# EAGLE design sensoresard (EAGLE 7.7.0)
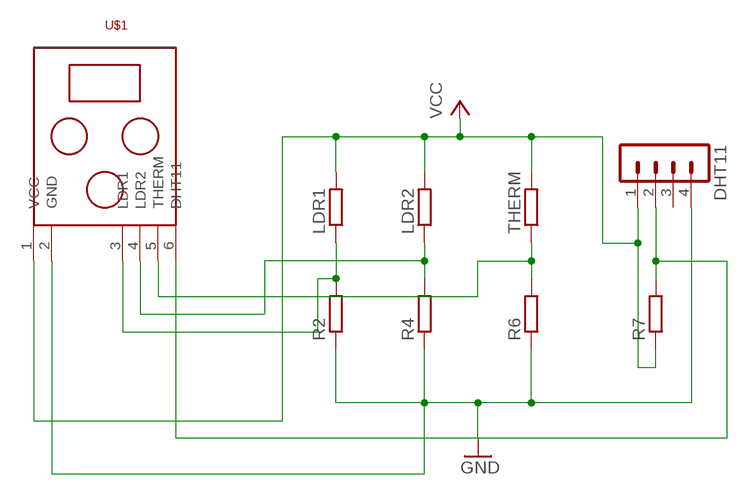
[diagram p0: schematic, sheet 1]

## Parts
DHT11  MA04-1  [MA04-1]
LDR1  R-EU_0204/7  [0204/7]
LDR2  R-EU_0204/7  [0204/7]
R2  R-EU_0204/7  [0204/7]
R4  R-EU_0204/7  [0204/7]
R6  R-EU_0204/7  [0204/7]
R7  R-EU_0204/7  [0204/7]
THERM  R-EU_0204/7  [0204/7]
U$1  PA  [PA]

## Nets
GND: DHT11.4 R2.1 R4.1 R6.1 U$1.2(GND)
N$1: LDR1.1 R2.2 U$1.3(LDR1)
N$2: LDR2.1 R4.2 U$1.4(LDR2)
N$3: R6.2 THERM.1 U$1.5(THERM)
N$4: DHT11.2 R7.2 U$1.6(DHT11)
VCC: DHT11.1 LDR1.2 LDR2.2 R7.1 THERM.2 U$1.1(VCC)
Unconnected: DHT11.3

## Library data of the parts
DHT11 = con-lstb:MA04-1: PIN HEADER; OC_FARNELL: unknown; OC_NEWARK: unknown
LDR1 LDR2 R2 R4 R6 R7 THERM = resistor:R-EU_: RESISTOR, European symbol
U$1 = sensorescaseros:PA

## Board
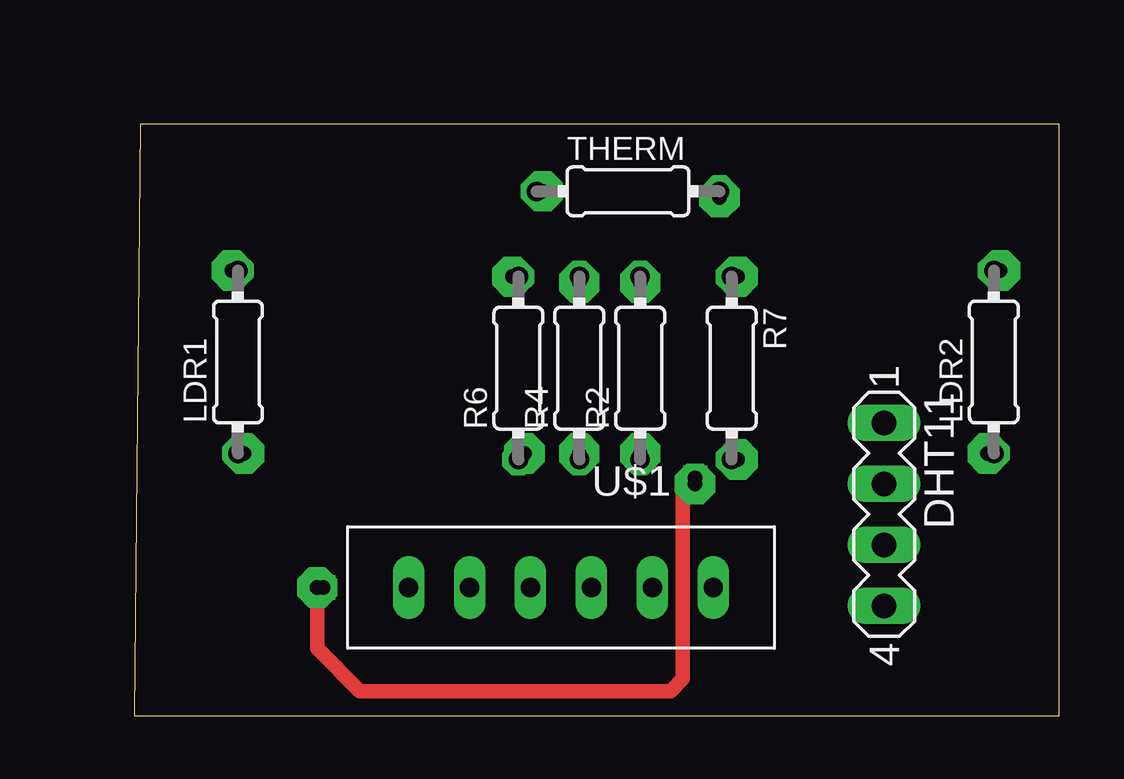
[diagram p1: board, top side]
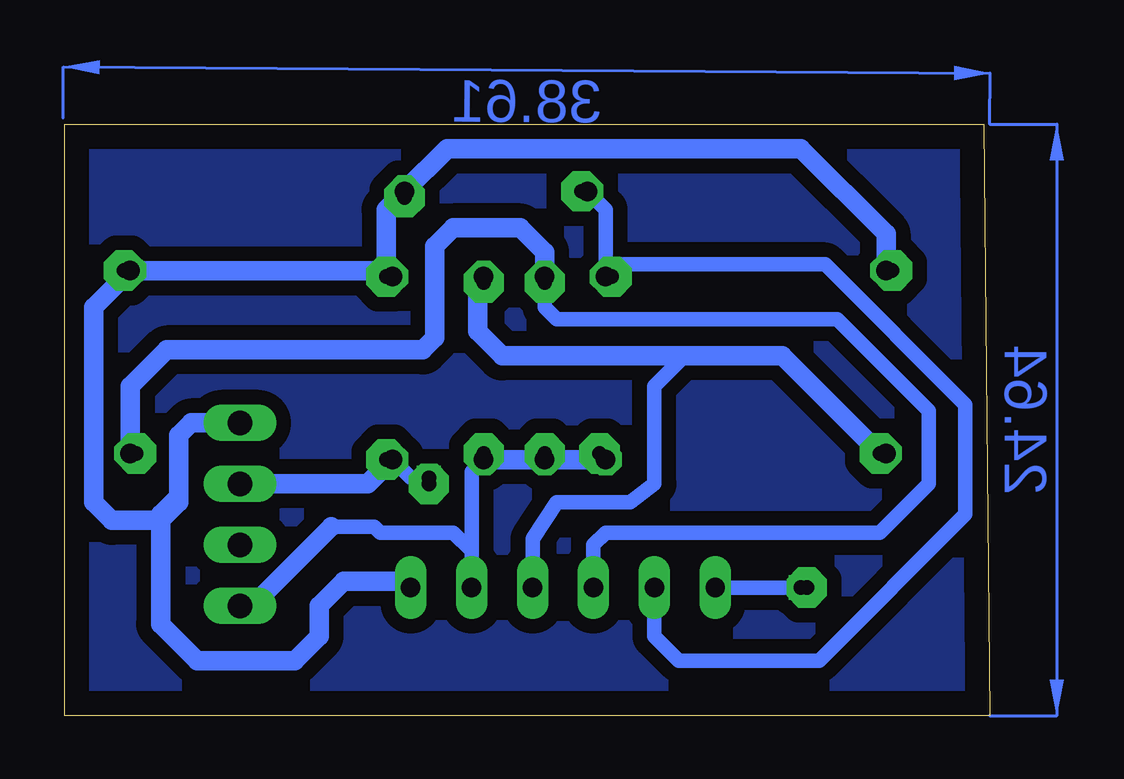
[diagram p2: board, bottom side, seen from below]

Size 38.53 x 24.63 mm. Coordinates in mm from the lower left corner, seen from the top.
Outline: 0,0 38.53,0 38.53,24.63 0.25,24.63 0,0
Copper layers (1*16): Top 0.035mm / dielectric 1.5mm / Bottom 0.035mm
Design rules "default": minimum track width 10mil, minimum drill 24mil, track to track 8mil, track to pad 8mil, pad to pad 8mil, via to via 8mil, smd to smd 8mil, copper to edge 40mil, drill to drill 8mil, minimum pad ring 10mil, minimum via ring 8mil, stop-mask expansion 4mil, vias tented up to drill 0mil, thermal gap 10mil

### Footprints (pad centres in the part's own frame; a part is rotated, then mirrored left to right if it is on the bottom)
MA04-1 = drill 1.016 long: 1 -3.81,0; 2 -1.27,0; 3 1.27,0; 4 3.81,0
0204/7 = drill 0.813 octagon: 1 -3.81,0; 2 3.81,0
PA = drill 0.8 long: 1 6.35,0; 2 3.81,0; 3 1.27,0; 4 -1.27,0; 5 -3.81,0; 6 -6.35,0

### Placement (x,y rotation side)
DHT11  31.24,8.38 270 top
LDR1  4.32,14.73 90 top
LDR2  35.81,14.73 90 top
R2  21.08,14.48 90 top
R4  18.54,14.48 90 top
R6  16,14.48 90 top
R7  24.89,14.48 270 top
THERM  20.57,21.84 0 top
U$1  17.78,5.33 0 top

### Tracks (layer width: path | path; a pad name or v marks a point on that pad's centre or on a via)
GND
  Bottom 0.61: 27.43,7.87 25.65,7.87 25.4,7.62 22.35,7.62 21.59,6.86 U$1.2 21.59,10.16 R2.1
  Bottom 0.813: R6.1 R4.1 R2.1 | DHT11.4 30.73,4.57 27.43,7.87
N$1  (via drill 0.6 pad 1.68)
  Bottom 0.61: U$1.3 19.05,7.37 18.03,8.89 14.99,8.89 13.97,9.65 13.97,13.72 12.7,14.99
  Bottom 0.813: LDR1.1 v4.57,10.92 8.64,14.99 12.7,14.99 20.32,14.99 21.34,16 21.34,18.03 R2.2
N$2  (via drill 0.6 pad 1.68)
  Bottom 0.61: U$1.4 16.51,7.11 16,7.62 4.57,7.62 2.54,9.65 2.54,12.7 6.35,16.51 18.03,16.51 18.54,17.02 v18.54,18.03 R4.2
  Bottom 0.813: R4.2 18.54,19.3 19.56,20.32 22.35,20.32 23.11,19.56 23.11,15.75 23.62,15.24 34.29,15.24 35.81,13.72 LDR2.1
N$3
  Bottom 0.61: THERM.1 16,21.08 R6.2 15.49,18.8 6.86,18.8 1.02,12.95 1.02,8.38 7.11,2.29 12.95,2.29 13.97,3.3 U$1.5
N$4  (via drill 0.6, 0.6 pad 1.68)
  Top 0.61: v7.87,5.33 v7.62,5.33 7.62,2.79 9.4,1.02 22.35,1.02 22.86,1.52 22.86,9.4 v23.37,9.91
  Bottom 0.61: U$1.6 v7.87,5.33 | v23.37,9.91 24.13,9.91 R7.2
  Bottom 0.813: R7.2 25.91,9.65 DHT11.2
N$5
  pour Bottom (isolate 0.61): 0,0 38.86,0 38.61,24.89 0,24.64
N$6  (via drill 0.6 pad 1.68)
  other vias: 4.06,18.54
N$7  (via drill 0.6 pad 1.68)
  other vias: 17.02,21.84
N$8  (via drill 0.6 pad 1.68)
  other vias: 15.75,18.29
N$9  (via drill 0.6 pad 1.68)
  other vias: 21.08,18.03
N$10  (via drill 0.6 pad 1.68)
  other vias: 25.15,18.29
N$11  (via drill 0.6 pad 1.68)
  other vias: 24.38,21.59
N$12  (via drill 0.6 pad 1.68)
  other vias: 36.07,18.54
N$13  (via drill 0.6 pad 1.68)
  other vias: 35.56,10.92
N$14  (via drill 0.6 pad 1.68)
  other vias: 25.15,10.67
N$15  (via drill 0.6 pad 1.68)
  other vias: 23.37,9.65
N$16  (via drill 0.6 pad 1.68)
  other vias: 21.08,10.92
N$17  (via drill 0.6 pad 1.68)
  other vias: 18.54,10.92
N$18  (via drill 0.6 pad 1.68)
  other vias: 16.26,10.92
VCC
  Bottom 0.813: 25.15,18.54 25.15,21.08 THERM.2 22.61,23.62 7.87,23.62 4.32,20.07 LDR1.2 | 25.15,18.54 LDR2.2 37.34,17.02 37.34,8.89 36.58,8.13 34.54,8.13 33.78,8.89 33.78,9.14 | 25.15,18.54 R7.1 | DHT11.1 33.27,12.19 33.78,11.68 33.78,9.14 | 33.78,9.14 34.54,8.38 34.54,3.81 33.02,2.29 28.96,2.29 27.94,3.3 27.94,4.57 26.92,5.59 24.38,5.59 U$1.1
(copper drawn outside any net)
  shapes: Bottom area x2